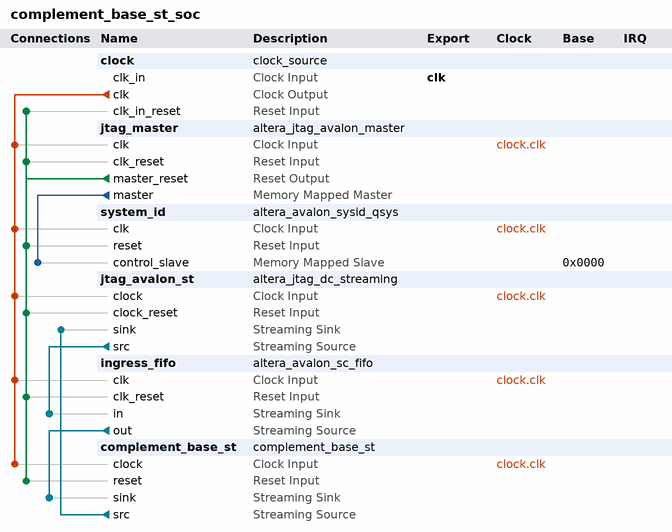
[diagram p0: system contents]
# Platform Designer (Qsys) system complement_base_st_soc, Cyclone V 5CSXFC6C6U23C8ES
# Parameters at their usual value, and those the tool derives, are not listed.
package require -exact qsys 13.1
create_system complement_base_st_soc
set_project_property DEVICE_FAMILY {Cyclone V}
set_project_property DEVICE 5CSXFC6C6U23C8ES

add_instance clock clock_source 13.1
set_instance_parameter_value clock clockFrequency 100000000

add_instance jtag_master altera_jtag_avalon_master 13.1

add_instance system_id altera_avalon_sysid_qsys 13.1
set_instance_parameter_value system_id id 6

add_instance jtag_avalon_st altera_jtag_dc_streaming 13.1
set_instance_parameter_value jtag_avalon_st PURPOSE 0
set_instance_parameter_value jtag_avalon_st UPSTREAM_FIFO_SIZE 0
set_instance_parameter_value jtag_avalon_st DOWNSTREAM_FIFO_SIZE 0
set_instance_parameter_value jtag_avalon_st MGMT_CHANNEL_WIDTH -1
set_instance_parameter_value jtag_avalon_st USE_PLI 0
set_instance_parameter_value jtag_avalon_st PLI_PORT 50000
set_instance_parameter_value jtag_avalon_st USE_DOWNSTREAM_READY 0
set_instance_parameter_value jtag_avalon_st COMPONENT_CLOCK 100000000
set_instance_parameter_value jtag_avalon_st FABRIC 2.0

add_instance ingress_fifo altera_avalon_sc_fifo 13.1
set_instance_parameter_value ingress_fifo BITS_PER_SYMBOL 8
set_instance_parameter_value ingress_fifo FIFO_DEPTH 16
set_instance_parameter_value ingress_fifo CHANNEL_WIDTH 0
set_instance_parameter_value ingress_fifo ERROR_WIDTH 0
set_instance_parameter_value ingress_fifo USE_FILL_LEVEL 0
set_instance_parameter_value ingress_fifo USE_MEMORY_BLOCKS 1
set_instance_parameter_value ingress_fifo USE_STORE_FORWARD 0

add_instance complement_base_st complement_base_st 1.0

# connections
add_connection clock.clk complement_base_st.clock clock
add_connection clock.clk ingress_fifo.clk clock
add_connection clock.clk jtag_avalon_st.clock clock
add_connection clock.clk jtag_master.clk clock
add_connection clock.clk system_id.clk clock
add_connection jtag_master.master_reset clock.clk_in_reset reset
add_connection jtag_master.master_reset complement_base_st.reset reset
add_connection jtag_master.master_reset ingress_fifo.clk_reset reset
add_connection jtag_master.master_reset jtag_avalon_st.clock_reset reset
add_connection jtag_master.master_reset jtag_master.clk_reset reset
add_connection jtag_master.master_reset system_id.reset reset
add_connection jtag_master.master system_id.control_slave avalon
set_connection_parameter_value jtag_master.master/system_id.control_slave baseAddress 0x0000
add_connection complement_base_st.src jtag_avalon_st.sink avalon_streaming
add_connection ingress_fifo.out complement_base_st.sink avalon_streaming
add_connection jtag_avalon_st.src ingress_fifo.in avalon_streaming

# exported interfaces
add_interface clk clock sink
set_interface_property clk EXPORT_OF clock.clk_in

set_interconnect_requirement {$system} qsys_mm.clockCrossingAdapter HANDSHAKE
set_interconnect_requirement {$system} qsys_mm.maxAdditionalLatency 1
set_interconnect_requirement {$system} qsys_mm.insertDefaultSlave false

save_system complement_base_st_soc.qsys
